# Altium schematic sheet LEDs.SchDoc
size A
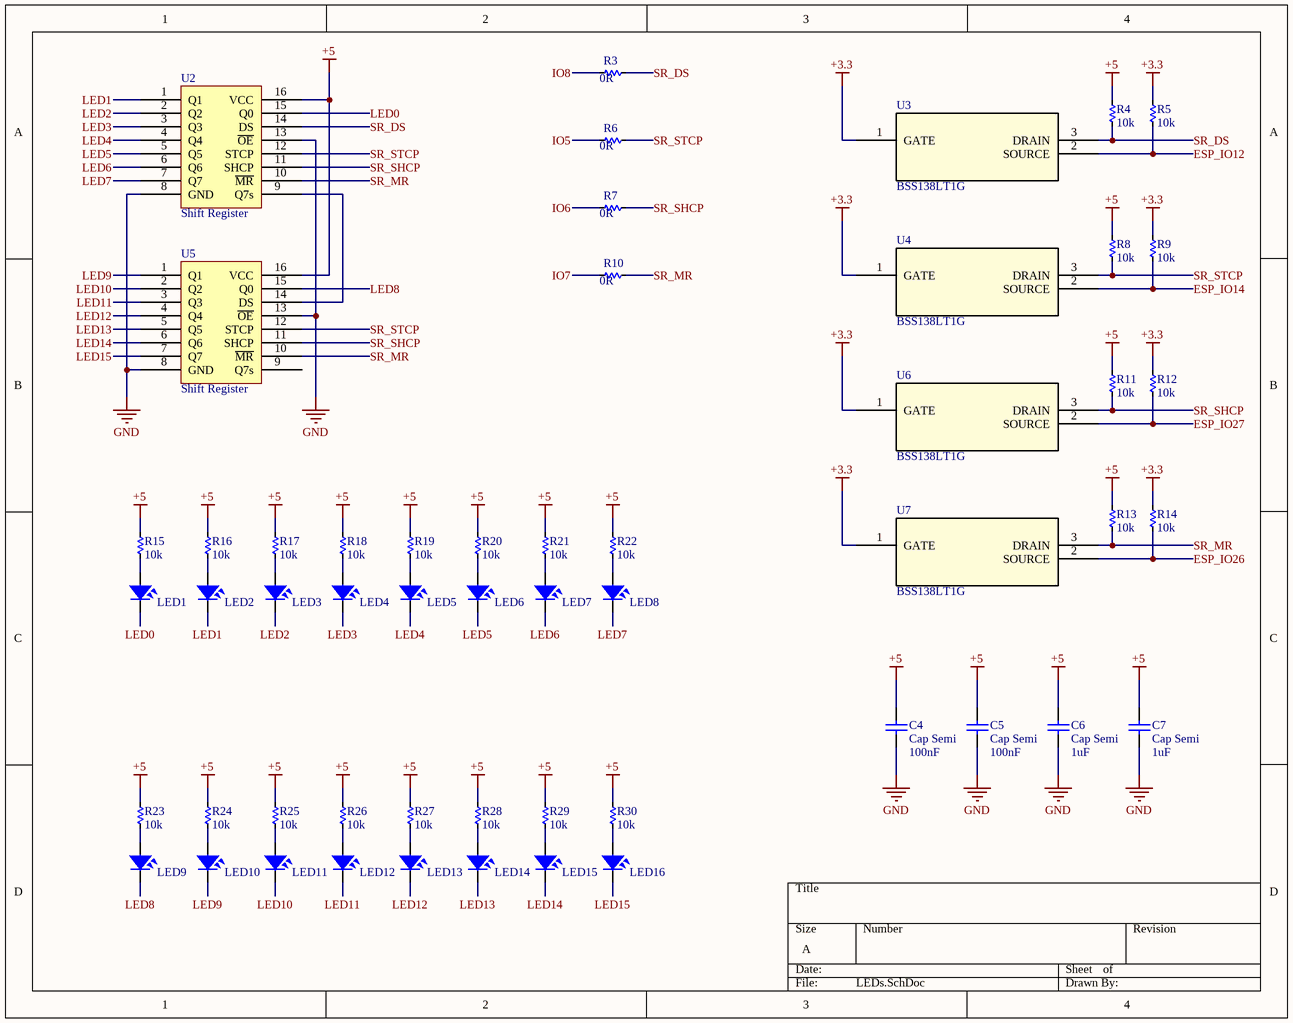
[diagram p0: LEDs.SchDoc]

## Parts
C4  Cap Semi  value 100nF  [1608[0603]]
C5  Cap Semi  value 100nF  [1608[0603]]
C6  Cap Semi  value 1uF  [1608[0603]]
C7  Cap Semi  value 1uF  [1608[0603]]
LED1  LED  [LED-0805-Red]  (value not drawn)
LED2  LED  [LED-0805-Red]  (value not drawn)
LED3  LED  [LED-0805-Red]  (value not drawn)
LED4  LED  [LED-0805-Red]  (value not drawn)
LED5  LED  [LED-0805-Red]  (value not drawn)
LED6  LED  [LED-0805-Red]  (value not drawn)
LED7  LED  [LED-0805-Red]  (value not drawn)
LED8  LED  [LED-0805-Red]  (value not drawn)
LED9  LED  [LED-0805-Red]  (value not drawn)
LED10  LED  [LED-0805-Red]  (value not drawn)
LED11  LED  [LED-0805-Red]  (value not drawn)
LED12  LED  [LED-0805-Red]  (value not drawn)
LED13  LED  [LED-0805-Red]  (value not drawn)
LED14  LED  [LED-0805-Red]  (value not drawn)
LED15  LED  [LED-0805-Red]  (value not drawn)
LED16  LED  [LED-0805-Red]  (value not drawn)
R3  value 0R  [RES-SMD-0603]  (hidden comment: Res)
R4  value 10k  [RES-SMD-0603]  (hidden comment: Res)
R5  value 10k  [RES-SMD-0603]  (hidden comment: Res)
R6  value 0R  [RES-SMD-0603]  (hidden comment: Res)
R7  value 0R  [RES-SMD-0603]  (hidden comment: Res)
R8  value 10k  [RES-SMD-0603]  (hidden comment: Res)
R9  value 10k  [RES-SMD-0603]  (hidden comment: Res)
R10  value 0R  [RES-SMD-0603]  (hidden comment: Res)
R11  value 10k  [RES-SMD-0603]  (hidden comment: Res)
R12  value 10k  [RES-SMD-0603]  (hidden comment: Res)
R13  value 10k  [RES-SMD-0603]  (hidden comment: Res)
R14  value 10k  [RES-SMD-0603]  (hidden comment: Res)
R15  value 10k  [RES-SMD-0603]  (hidden comment: Res)
R16  value 10k  [RES-SMD-0603]  (hidden comment: Res)
R17  value 10k  [RES-SMD-0603]  (hidden comment: Res)
R18  value 10k  [RES-SMD-0603]  (hidden comment: Res)
R19  value 10k  [RES-SMD-0603]  (hidden comment: Res)
R20  value 10k  [RES-SMD-0603]  (hidden comment: Res)
R21  value 10k  [RES-SMD-0603]  (hidden comment: Res)
R22  value 10k  [RES-SMD-0603]  (hidden comment: Res)
R23  value 10k  [RES-SMD-0603]  (hidden comment: Res)
R24  value 10k  [RES-SMD-0603]  (hidden comment: Res)
R25  value 10k  [RES-SMD-0603]  (hidden comment: Res)
R26  value 10k  [RES-SMD-0603]  (hidden comment: Res)
R27  value 10k  [RES-SMD-0603]  (hidden comment: Res)
R28  value 10k  [RES-SMD-0603]  (hidden comment: Res)
R29  value 10k  [RES-SMD-0603]  (hidden comment: Res)
R30  value 10k  [RES-SMD-0603]  (hidden comment: Res)
U2  Shift Register  [SO16]
U3  BSS138LT1G  [SOT23-3_ONS]
U4  BSS138LT1G  [SOT23-3_ONS]
U5  Shift Register  [SO16]
U6  BSS138LT1G  [SOT23-3_ONS]
U7  BSS138LT1G  [SOT23-3_ONS]

## Nets
+3.3: R5.1 R9.1 R12.1 R14.1 U3.1(GATE) U4.1(GATE) U6.1(GATE) U7.1(GATE)
+5: C4.1 C5.1 C6.1 C7.1 R4.1 R8.1 R11.1 R13.1 R15.1 R16.1 R17.1 R18.1 R19.1 R20.1 R21.1 R22.1 R23.1 R24.1 R25.1 R26.1 R27.1 R28.1 R29.1 R30.1 U2.16(VCC) U5.16(VCC)
GND: C4.2 C5.2 C6.2 C7.2 U2.8(GND) U2.13(~{OE}) U5.8(GND) U5.13(~{OE})
ESP_IO12: R5.2 U3.2(SOURCE)
ESP_IO14: R9.2 U4.2(SOURCE)
ESP_IO26: R14.2 U7.2(SOURCE)
ESP_IO27: R12.2 U6.2(SOURCE)
IO5: R6.2
IO6: R7.2
IO7: R10.2
IO8: R3.2
LED0: LED1.2 U2.15(Q0)
LED1: LED2.2 U2.1(Q1)
LED2: LED3.2 U2.2(Q2)
LED3: LED4.2 U2.3(Q3)
LED4: LED5.2 U2.4(Q4)
LED5: LED6.2 U2.5(Q5)
LED6: LED7.2 U2.6(Q6)
LED7: LED8.2 U2.7(Q7)
LED8: LED9.2 U5.15(Q0)
LED9: LED10.2 U5.1(Q1)
LED10: LED11.2 U5.2(Q2)
LED11: LED12.2 U5.3(Q3)
LED12: LED13.2 U5.4(Q4)
LED13: LED14.2 U5.5(Q5)
LED14: LED15.2 U5.6(Q6)
LED15: LED16.2 U5.7(Q7)
SR_DS: R3.1 R4.2 U2.14(DS) U3.3(DRAIN)
SR_MR: R10.1 R13.2 U2.10(~{MR}) U5.10(~{MR}) U7.3(DRAIN)
SR_SHCP: R7.1 R11.2 U2.11(SHCP) U5.11(SHCP) U6.3(DRAIN)
SR_STCP: R6.1 R8.2 U2.12(STCP) U4.3(DRAIN) U5.12(STCP)
NetLED1_1: LED1.1 R15.2
NetLED2_1: LED2.1 R16.2
NetLED3_1: LED3.1 R17.2
NetLED4_1: LED4.1 R18.2
NetLED5_1: LED5.1 R19.2
NetLED6_1: LED6.1 R20.2
NetLED7_1: LED7.1 R21.2
NetLED8_1: LED8.1 R22.2
NetLED9_1: LED9.1 R23.2
NetLED10_1: LED10.1 R24.2
NetLED11_1: LED11.1 R25.2
NetLED12_1: LED12.1 R26.2
NetLED13_1: LED13.1 R27.2
NetLED14_1: LED14.1 R28.2
NetLED15_1: LED15.1 R29.2
NetLED16_1: LED16.1 R30.2
NetU2_9: U2.9(Q7s) U5.14(DS)

Not connected (* = marked no-connect by the designer): U5 9(Q7s)

## Library data of the parts
C4-C7 = Cap Semi: Capacitor (Semiconductor SIM Model); Published: 8-Jun-2000; LatestRevisionDate: 29-May-2009; LatestRevisionNote: IPC-7351 Footprint Added.; PackageReference: C1206; Publisher: Altium Limited; PackageDescription: Chip Capacitor
LED1-LED16 = LED SMD: Value: LED 3 - 5 ly 2 Colour
R3-R30 = Res-SMD: Resistor; Manufacturer: Generic Components; Class: Passive; Published: 08/06/2000; Publisher: Altium Hobart Technology Centre
U2 U5 = 74HC595: 74HC Shift Register SOIC-16_150mil Registers ROHS; Value: 74HC595D
U3 U4 U6 U7 = BSS138LT1G: No Description Available; Vendor: ON Semiconductor; Built_By: EMA_Jessica; SourceLibrary: ON_Semiconductor_2019-12-30; Manufacturer_Part_Number: BSS138LT1G; Copyright: Copyright (C) 2018 Accelerated Designs. All rights reserved; RefDes: RefDes; Type: DEV